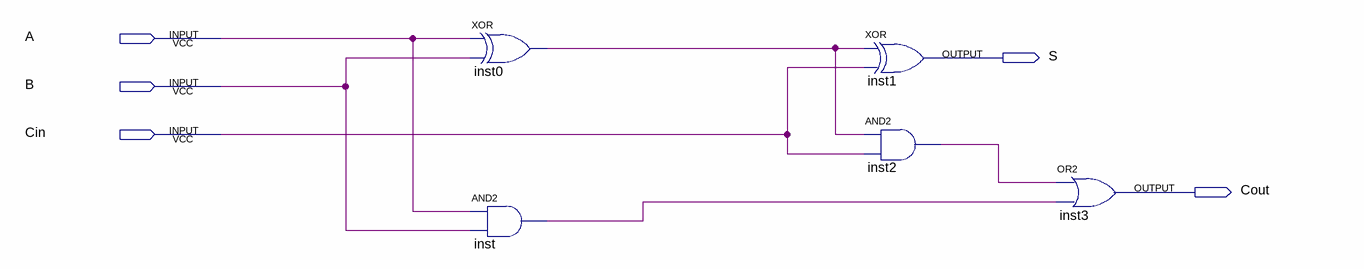
[diagram p0: schematic sheet]
// Quartus schematic FullAdder_Demo.bdf as structural Verilog: 5 symbols, 5 pins
module FullAdder_Demo (
  input  A,
  input  B,
  input  Cin,
  output S,
  output Cout
);

  wire inst0_out, inst2_out, inst_out;

  xor inst0 (inst0_out, A, B);
  and inst (inst_out, A, B);
  xor inst1 (S, inst0_out, Cin);
  and inst2 (inst2_out, inst0_out, Cin);
  or inst3 (Cout, inst2_out, inst_out);
endmodule
